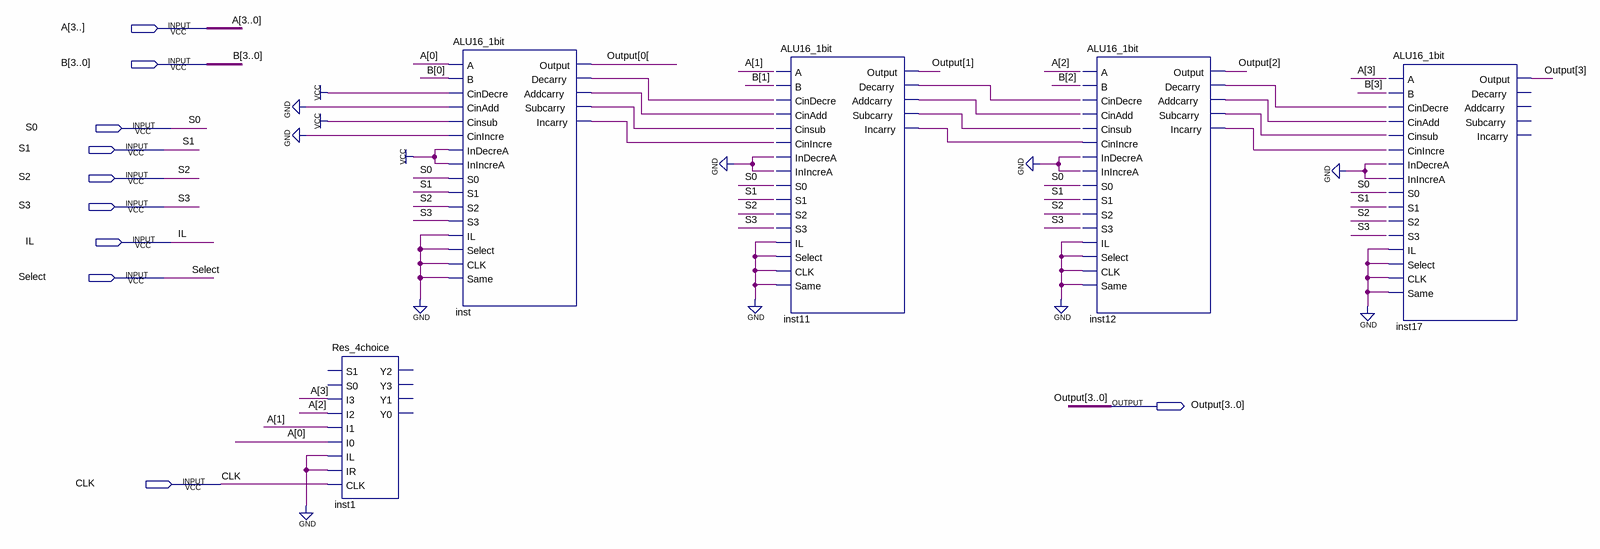
[diagram p0: schematic sheet]
// Quartus schematic ALU16_2bit.bdf as structural Verilog: 5 symbols, 10 pins
module ALU16_2bit (
  input  \A[3..] ,
  input  [3:0] B,
  input  S0,
  input  S1,
  input  S2,
  input  S3,
  input  IL,
  input  Select,
  input  CLK,
  output [3:0] Output
);

  wire inst11_addcarry, inst11_decarry, inst11_incarry, inst11_subcarry, inst12_addcarry, inst12_decarry,
       inst12_incarry, inst12_subcarry, inst_addcarry, inst_decarry, inst_incarry, inst_subcarry, \Output[0[ ;
  wire [3:0] A;

  Res_4choice inst1 (
    .I3(A[3]), .I2(A[2]), .I1(A[1]), .I0(A[0]), .IL(1'b0), .IR(1'b0), .CLK(CLK));  // open: S1, S0, Y2, Y3, Y1, Y0
  ALU16_1bit inst (
    .A(A[0]), .B(B[0]), .CinDecre(1'b1), .CinAdd(1'b0), .Cinsub(1'b1), .CinIncre(1'b0), .InDecreA(1'b1),
    .InIncreA(1'b1), .S0(S0), .S1(S1), .S2(S2), .S3(S3), .IL(1'b0), .Select(1'b0), .CLK(1'b0), .Same(1'b0),
    .Output(\Output[0[ ), .Decarry(inst_decarry), .Addcarry(inst_addcarry), .Subcarry(inst_subcarry),
    .Incarry(inst_incarry));
  ALU16_1bit inst11 (
    .IL(1'b0), .Select(1'b0), .CLK(1'b0), .Same(1'b0), .Output(Output[1]), .Decarry(inst11_decarry),
    .Addcarry(inst11_addcarry), .Subcarry(inst11_subcarry), .Incarry(inst11_incarry));  // open: A, B, CinDecre, CinAdd, Cinsub, CinIncre, InDecreA, InIncreA, S0, S1, S2, S3
  ALU16_1bit inst12 (
    .CinIncre(inst11_incarry), .IL(1'b0), .Select(1'b0), .CLK(1'b0), .Same(1'b0), .Output(Output[2]),
    .Decarry(inst12_decarry), .Addcarry(inst12_addcarry), .Subcarry(inst12_subcarry), .Incarry(inst12_incarry));  // open: A, B, CinDecre, CinAdd, Cinsub, InDecreA, InIncreA, S0, S1, S2, S3
  ALU16_1bit inst17 (
    .IL(1'b0), .Select(1'b0), .CLK(1'b0), .Same(1'b0), .Output(Output[3]));  // open: A, B, CinDecre, CinAdd, Cinsub, CinIncre, InDecreA, InIncreA, S0, S1, S2, S3, Decarry, Addcarry, Subcarry, Incarry
endmodule
